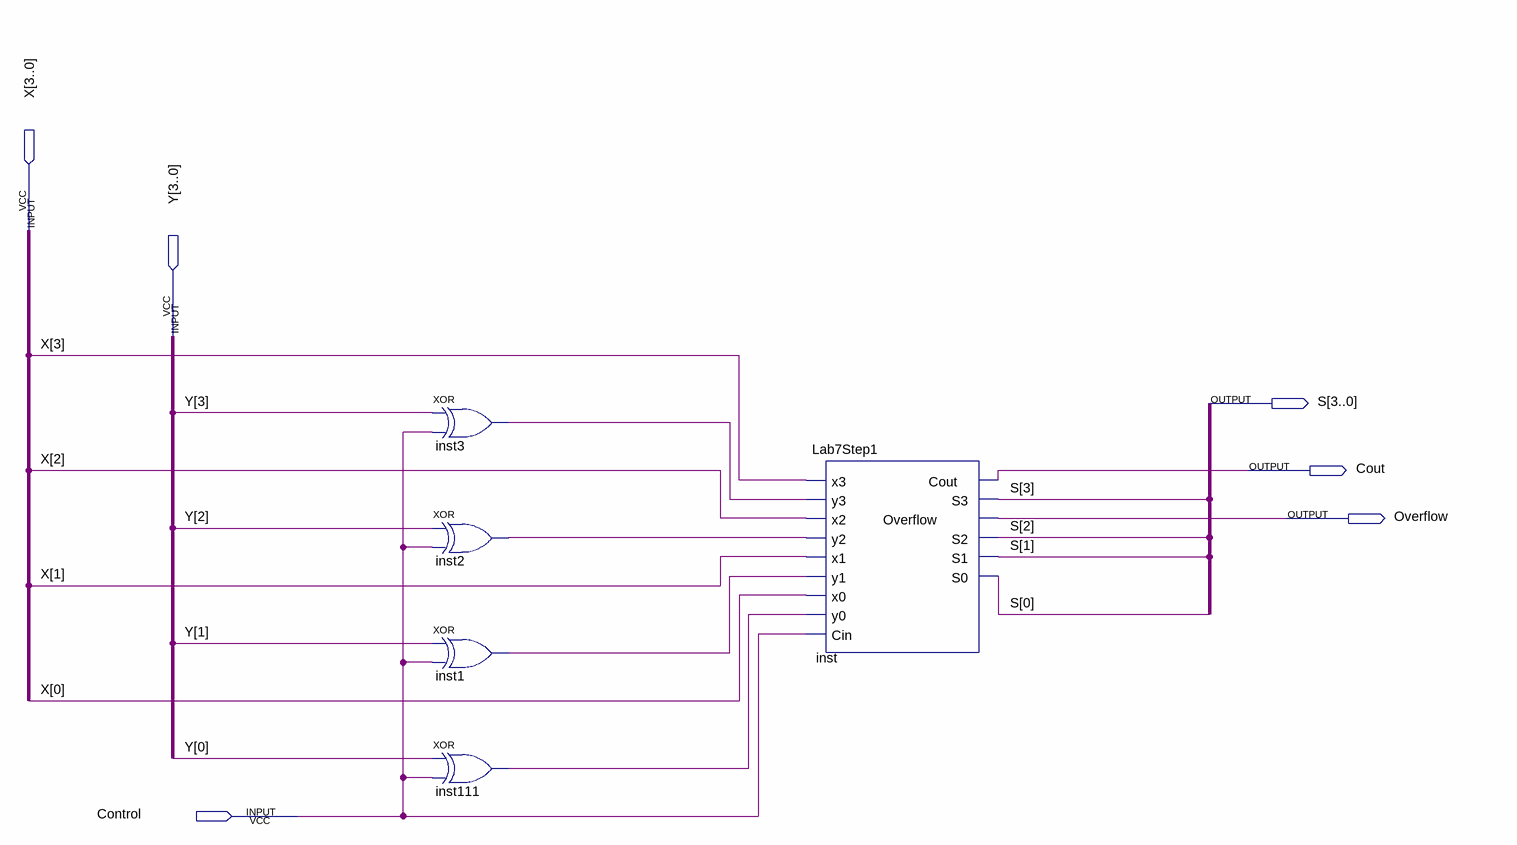
[diagram p0: schematic sheet]
// Quartus schematic Lab7Step2.bdf as structural Verilog: 5 symbols, 6 pins
module Lab7Step2 (
  input  [3:0] X,
  input  [3:0] Y,
  input  Control,
  output [3:0] S,
  output Cout,
  output Overflow
);

  wire inst1_out, inst2_out, inst3_out, inst111_out;

  xor inst3 (inst3_out, Y[3], Control);
  xor inst2 (inst2_out, Y[2], Control);
  xor inst1 (inst1_out, Y[1], Control);
  xor inst111 (inst111_out, Y[0], Control);
  Lab7Step1 inst (
    .x3(X[3]), .y3(inst3_out), .x2(X[2]), .y2(inst2_out), .x1(X[1]), .y1(inst1_out), .x0(X[0]),
    .y0(inst111_out), .Cin(Control), .Cout(Cout), .S3(S[3]), .Overflow(Overflow), .S2(S[2]), .S1(S[1]),
    .S0(S[0]));
endmodule
